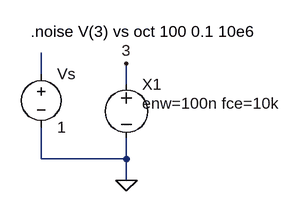
[diagram p0: schematic noisegentest.asc]
noisegentest.asc, the LTspice schematic file:
Version 4
SHEET 1 1064 680
WIRE -256 144 -256 112
WIRE -128 160 -128 128
WIRE -256 272 -256 224
WIRE -128 272 -128 240
WIRE -128 272 -256 272
WIRE -128 304 -128 272
FLAG -128 304 0
FLAG -128 128 3
SYMBOL voltage -256 128 R0
WINDOW 123 0 0 Left 0
WINDOW 39 0 0 Left 0
SYMATTR InstName Vs
SYMATTR Value 1
SYMBOL noisegen -128 144 R0
WINDOW 39 24 44 Left 0
SYMATTR SpiceLine enw=100n fce=10k
SYMATTR InstName X1
TEXT -272 80 Left 0 !.noise V(3) vs oct 100 0.1 10e6

The netlist it stands for:
* noisegentest.asc
Vs N001 0 1
XX1 3 0 noisegen enw=100n fce=10k  ; pins plus minus
.noise V(3) vs oct 100 0.1 10e6
.backanno
.end